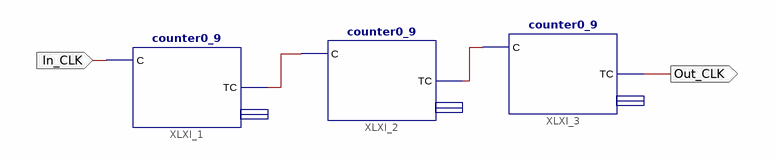
[diagram p0: schematic sheet 1]
// Xilinx ISE schematic Div1k.sch (spartan6) as structural Verilog: 3 symbols, 2 ports
module Div1k (
  input  In_CLK,
  output Out_CLK
);

  wire XLXN_1, XLXN_2;

  counter0_9 XLXI_1 (.C(In_CLK), .TC(XLXN_1));  // open: count
  counter0_9 XLXI_2 (.C(XLXN_1), .TC(XLXN_2));  // open: count
  counter0_9 XLXI_3 (.C(XLXN_2), .TC(Out_CLK));  // open: count
endmodule
